# Altium schematic sheet LCD.SchDoc
size A4
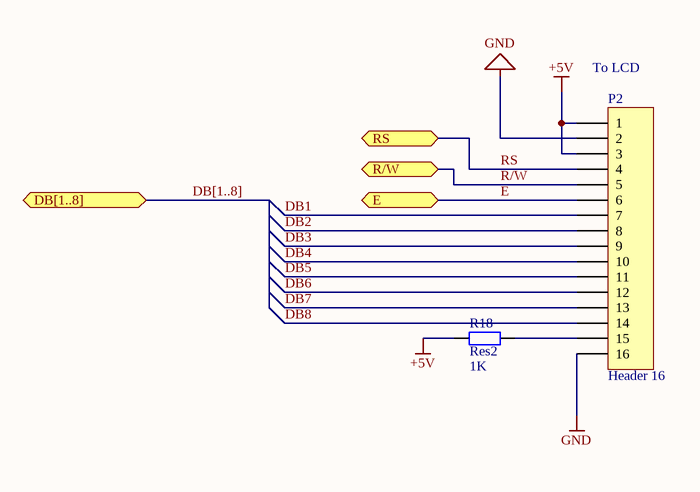
[diagram p0: LCD.SchDoc]

## Parts
P2  Header 16  [S16B-PUDSS-1]
R18  Res2  value 1K  [0603]

## Ports
DB[1..8] (bidir), E, R/W, RS

## Nets
+5V: P2.1 P2.3 R18.1
GND: P2.2 P2.16
DB1: P2.7
DB2: P2.8
DB3: P2.9
DB4: P2.10
DB5: P2.11
DB6: P2.12
DB7: P2.13
DB8: P2.14
E: P2.6 ; port E
R/W: P2.5 ; port R/W
RS: P2.4 ; port RS
NetP2_15: P2.15 R18.2

## Buses and harness runs
bus DB[1..8] = port DB[1..8]

## Notes on the sheet
- (near P2) To LCD

## Library data of the parts
P2 = Header 16: Header, 16-Pin; LatestRevisionDate: 17-Jul-2002; LatestRevisionNote: Re-released for DXP Platform.; Publisher: Altium Limited; farnell: 1830823
R18 = Res2: Resistor; Published: 8-Jun-2000; LatestRevisionDate: 17-Jul-2002; LatestRevisionNote: Re-released for DXP Platform.; PackageReference: AXIAL-0.4; Publisher: Altium Limited; PackageDescription: Axial Device, Thru-Hole; 2 Leads; 0.4 in Pin Spacing